# Altium schematic sheet RheoBoard_V8.SchDoc
size A2; SheetNumber: 1; SheetTotal: 1
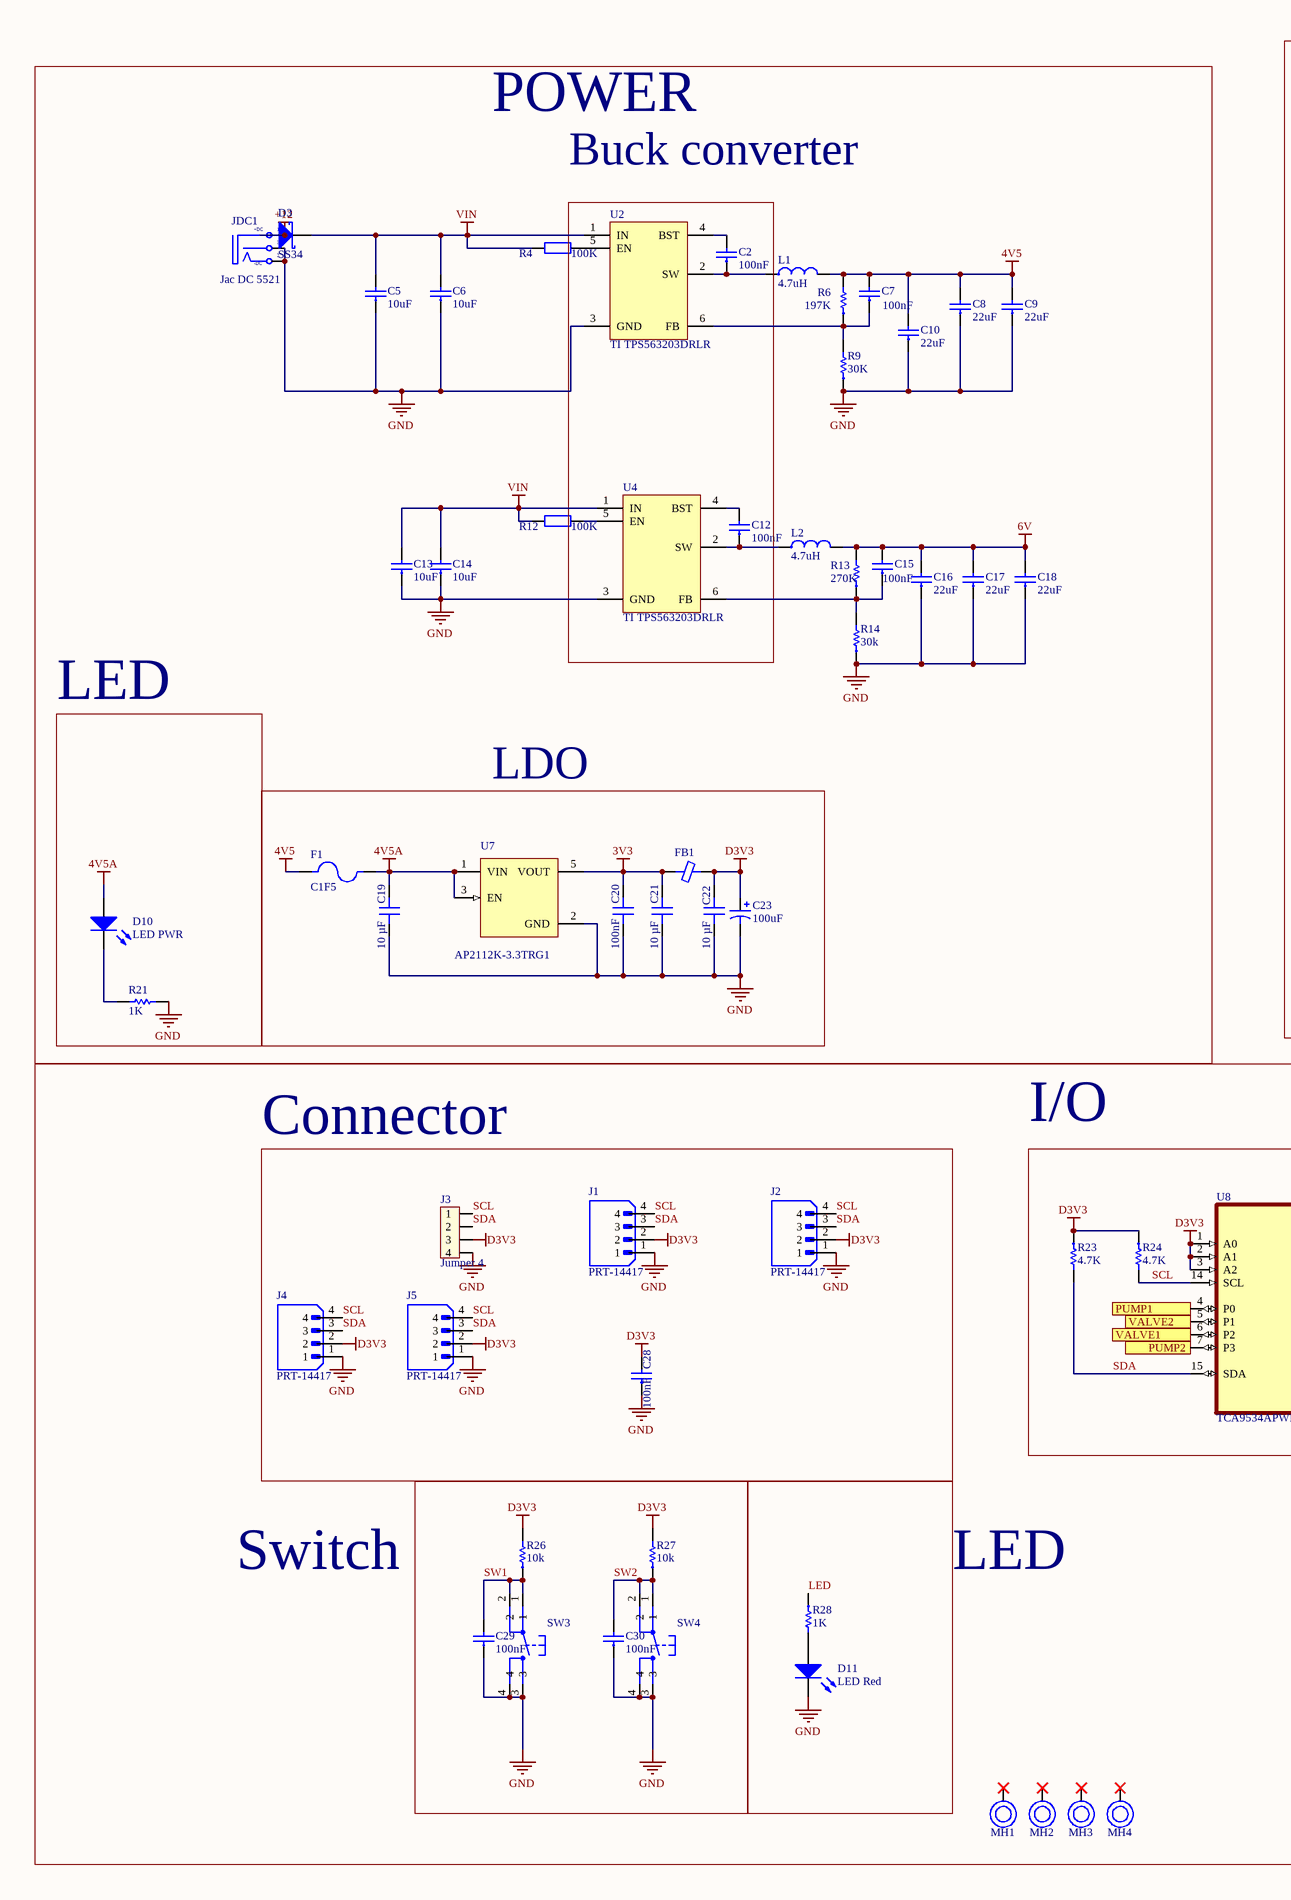
[diagram p0: RheoBoard_V8.SchDoc, left]
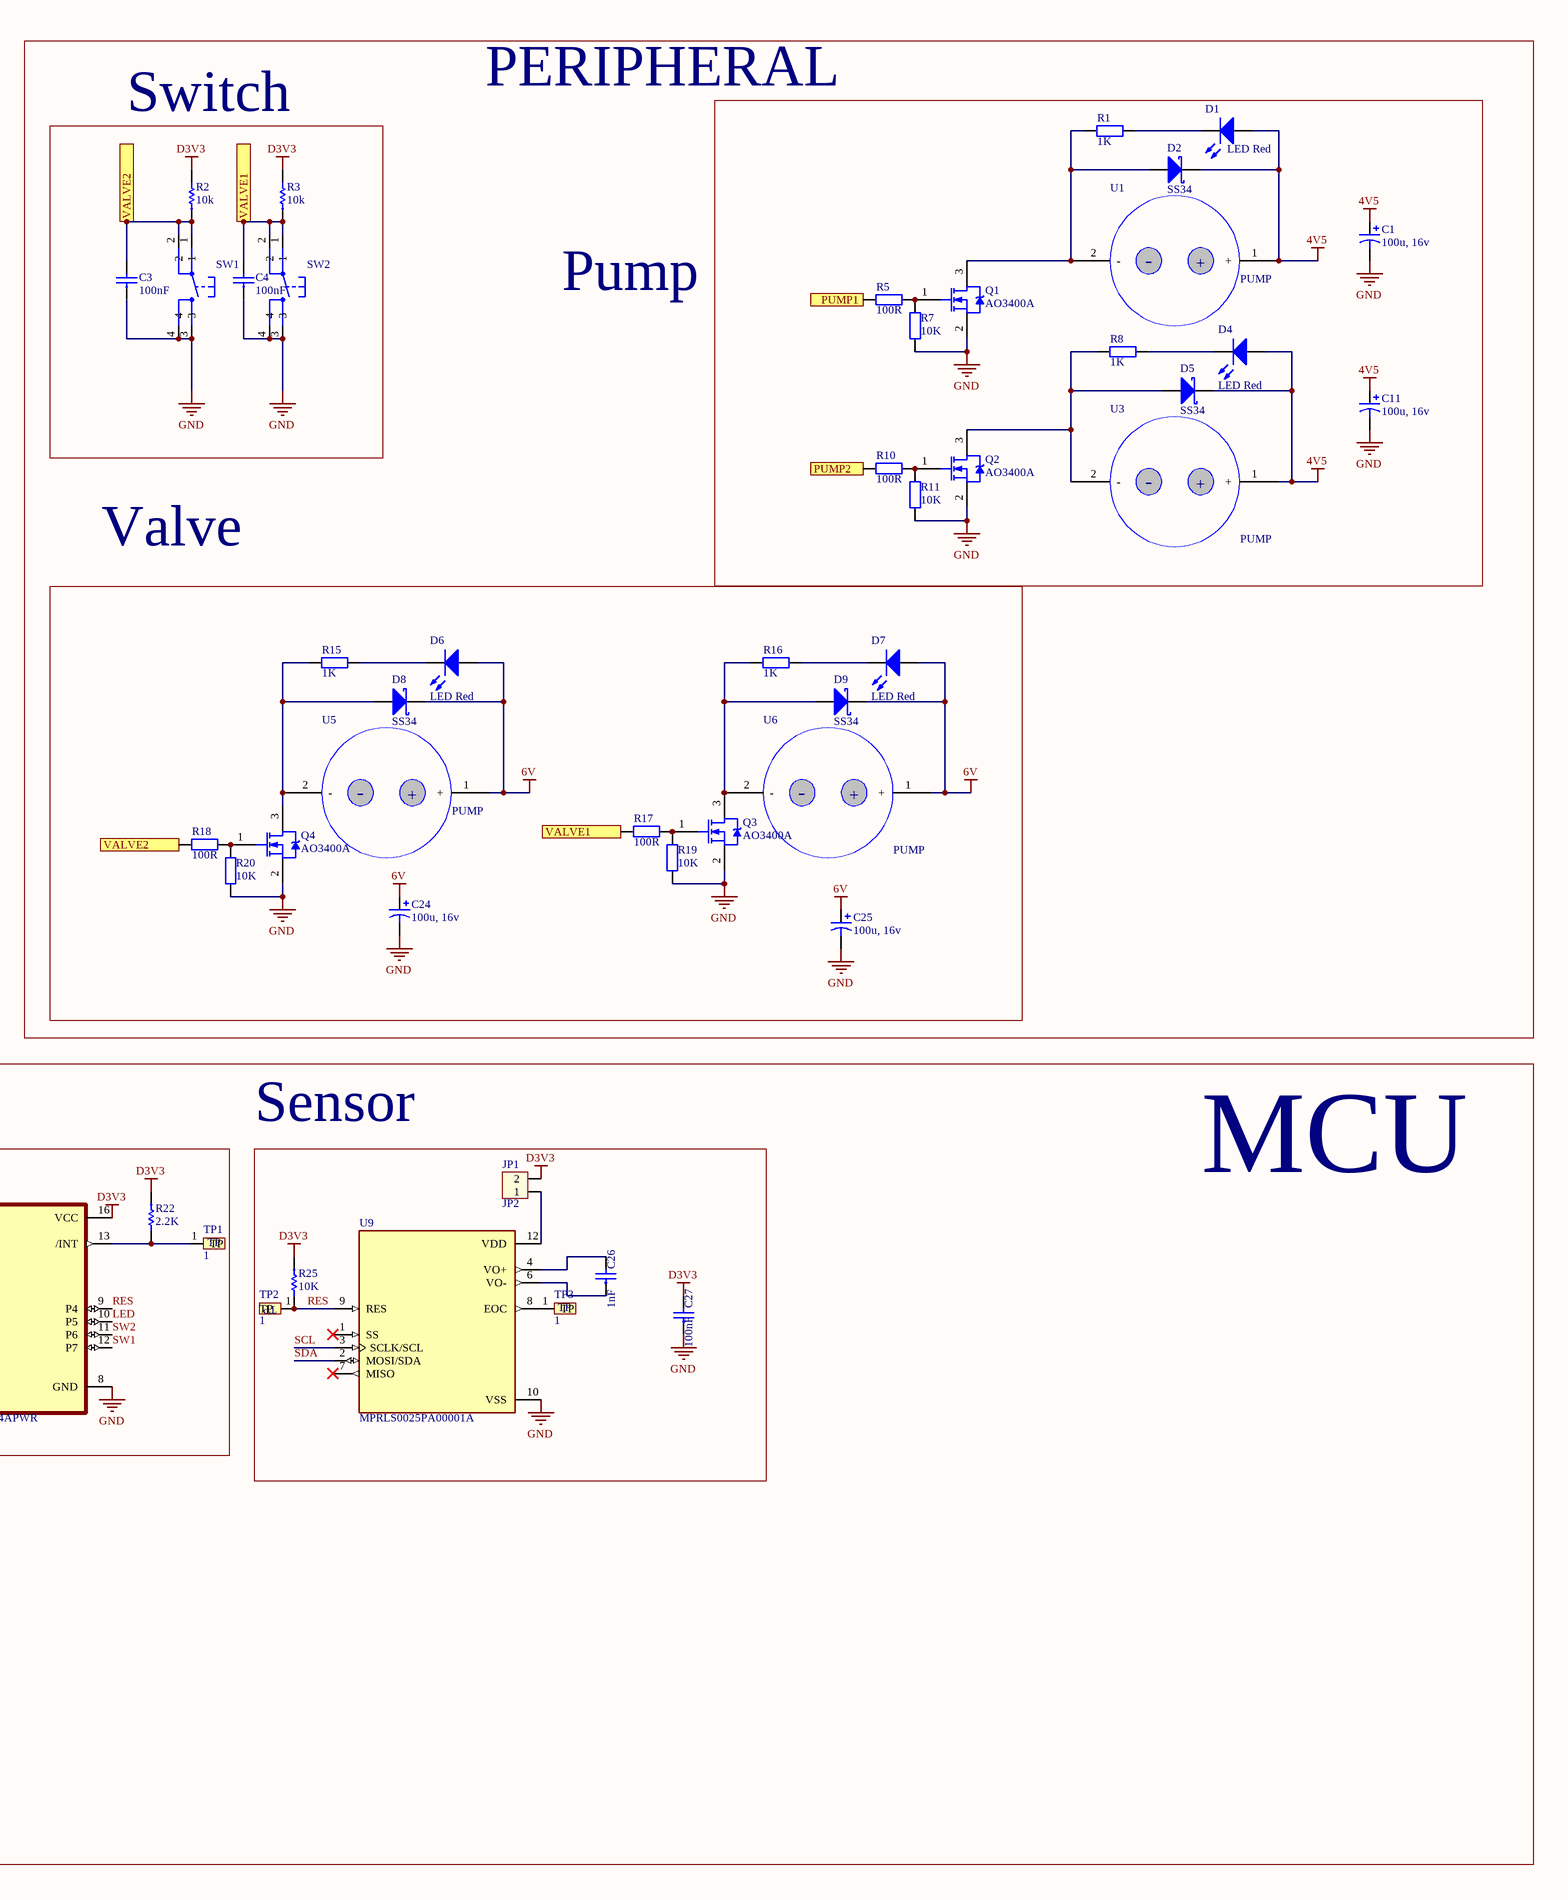
[diagram p1: RheoBoard_V8.SchDoc, right]

## Parts
C1  value 100u, 16v  [CAPACITOR SIZE_D(D6.6)]  (hidden comment: CAP ALUM 100UF 20% 16V SMD)
C2  100nF  [C0603]
C3  100nF  [C0603]
C4  100nF  [C0603]
C5  10uF  [CN-SMD-0603]
C6  10uF  [CN-SMD-0603]
C7  100nF  [C0603]
C8  22uF  [CN-SMD-0603]
C9  22uF  [CN-SMD-0603]
C10  22uF  [CN-SMD-0603]
C11  value 100u, 16v  [CAPACITOR SIZE_D(D6.6)]  (hidden comment: CAP ALUM 100UF 20% 16V SMD)
C12  100nF  [C0603]
C13  10uF  [CN-SMD-0603]
C14  10uF  [CN-SMD-0603]
C15  100nF  [C0603]
C16  22uF  [CN-SMD-0603]
C17  22uF  [CN-SMD-0603]
C18  22uF  [CN-SMD-0603]
C19  10 µF  [C0603]
C20  100nF  [C0603]
C21  10 µF  [C0603]
C22  10 µF  [C0603]
C23  value 100uF  [CAPACITOR SIZE_D(D6.6)]  (hidden comment: CAP ALUM 100UF 20% 16V SMD)
C24  value 100u, 16v  [CAPACITOR SIZE_D(D6.6)]  (hidden comment: CAP ALUM 100UF 20% 16V SMD)
C25  value 100u, 16v  [CAPACITOR SIZE_D(D6.6)]  (hidden comment: CAP ALUM 100UF 20% 16V SMD)
C26  1nF  [C0603]
C27  100nF  [C0603]
C28  100nF  [C0603]
C29  100nF  [C0603]
C30  100nF  [C0603]
D1  LED Red  [LED0603-R]
D2  SS34  [DO-214AC]
D3  SS34  [DO-214AC]
D4  LED Red  [LED0603-R]
D5  SS34  [DO-214AC]
D6  LED Red  [LED0603-R]
D7  LED Red  [LED0603-R]
D8  SS34  [DO-214AC]
D9  SS34  [DO-214AC]
D10  value LED PWR  [LED0603-R]  (hidden comment: LED Red)
D11  LED Red  [LED0603-R]
F1  C1F5  [FUSE C1F5]
FB1  330 Ohms @ 100 MHz  [L0603]  (value not drawn)
J1  PRT-14417  [SPARKFUN_PRT-14417]
J2  PRT-14417  [SPARKFUN_PRT-14417]
J3  Jumper 4  [JP4]
J4  PRT-14417  [SPARKFUN_PRT-14417]
J5  PRT-14417  [SPARKFUN_PRT-14417]
JDC1  Jac DC 5521  [DC0]
JP1  JP2  [CON2]
L1  4.7uH  [IND-0420-2R2]
L2  4.7uH  [IND-0420-2R2]
MH1  MOUNTING HOLE  [M3]  (value not drawn)
MH2  MOUNTING HOLE  [M3]  (value not drawn)
MH3  MOUNTING HOLE  [M3]  (value not drawn)
MH4  MOUNTING HOLE  [M3]  (value not drawn)
Q1  AO3400A  [SOT-23]
Q2  AO3400A  [SOT-23]
Q3  AO3400A  [SOT-23]
Q4  AO3400A  [SOT-23]
R1  value 1K  [R0603]  (hidden comment: RES 1K 5% 1/10W 0603)
R2  10k  [R0603]
R3  10k  [R0603]
R4  value 100K  [R0603]  (hidden comment: RES 100K 5% 1/10W 0603)
R5  value 100R  [R0603]  (hidden comment: RES 100R 5% 1/10W 0603)
R6  197K  [R0603]
R7  value 10K  [R0603]  (hidden comment: RES 10K 5% 1/10W 0603)
R8  value 1K  [R0603]  (hidden comment: RES 1K 5% 1/10W 0603)
R9  30K  [R0603]
R10  value 100R  [R0603]  (hidden comment: RES 100R 5% 1/10W 0603)
R11  value 10K  [R0603]  (hidden comment: RES 10K 5% 1/10W 0603)
R12  value 100K  [R0603]  (hidden comment: RES 100K 5% 1/10W 0603)
R13  270K  [R0603]
R14  30k  [R0603]
R15  value 1K  [R0603]  (hidden comment: RES 1K 5% 1/10W 0603)
R16  value 1K  [R0603]  (hidden comment: RES 1K 5% 1/10W 0603)
R17  value 100R  [R0603]  (hidden comment: RES 100R 5% 1/10W 0603)
R18  value 100R  [R0603]  (hidden comment: RES 100R 5% 1/10W 0603)
R19  value 10K  [R0603]  (hidden comment: RES 10K 5% 1/10W 0603)
R20  value 10K  [R0603]  (hidden comment: RES 10K 5% 1/10W 0603)
R21  1K  [R0603]
R22  2.2K  [R0603]
R23  4.7K  [R0603]
R24  4.7K  [R0603]
R25  10K  [R0603]
R26  10k  [R0603]
R27  10k  [R0603]
R28  1K  [R0603]
SW1  SW2  [SWITCH]  (value not drawn)
SW2  SW2  [SWITCH]  (value not drawn)
SW3  SW2  [SWITCH]  (value not drawn)
SW4  SW2  [SWITCH]  (value not drawn)
TP1  1  [TP]
TP2  1  [TP]
TP3  1  [TP]
U1  PUMP  [Pump]
U2  TI TPS563203DRLR  [SOT50P160X60-6N]
U3  PUMP  [Pump]
U4  TI TPS563203DRLR  [SOT50P160X60-6N]
U5  PUMP  [Pump]
U6  PUMP  [Pump]
U7  AP2112K-3.3TRG1  [SOT-23-5]
U8  TCA9534APWR  [SOP65P640X120-16N]
U9  MPRLS0025PA00001A  [XDCR_MPRLS0025PA00001A]

## Sub-sheets
Buck converter = File Name: no entries
Connector = File Name: no entries
I/O = File Name: no entries
LDO = File Name: no entries
LED = File Name: no entries
LED = File Name: no entries
MCU = File Name: no entries
PERIPHERAL = File Name: no entries
POWER = File Name: no entries
Pump = File Name: no entries
Sensor = File Name: no entries
Switch = File Name: no entries
Switch = File Name: no entries
Valve = File Name: no entries

## Ports
PUMP1 (in), PUMP1 (out), PUMP2 (in), PUMP2 (out), VALVE1 (in), VALVE1 (out), VALVE2 (in), VALVE2 (out)

## Nets
3V3: C20.2 C21.2 FB1.1 U7.5(VOUT)
4V5: C1.1 C7.2 C8.2 C9.2 C10.2 C11.1 D1.1(A) D2.2(K) D4.1(A) D5.2(K) F1.1 L1.2 R6.2 U1.1(+) U3.1(+)
4V5A: C19.2 D10.1(A) F1.2 U7.1(VIN) U7.3(EN)
6V: C15.2 C16.2 C17.2 C18.2 C24.1 C25.1 D6.1(A) D7.1(A) D8.2(K) D9.2(K) L2.2 R13.2 U5.1(+) U6.1(+)
+12: D3.1(A) JDC1.1(T)
D3V3: C22.2 C23.1 C27.2 C28.2 FB1.2 J1.2 J2.2 J3.3 J4.2 J5.2 JP1.2 R2.2 R3.2 R22.1 R23.1 R24.1 R25.1 R26.2 R27.2 U8.1(A0) U8.2(A1) U8.3(A2) U8.16(VCC)
GND: C1.2 C3.1 C4.1 C5.1 C6.1 C8.1 C9.1 C10.1 C11.2 C13.1 C14.1 C16.1 C17.1 C18.1 C19.1 C20.1 C21.1 C22.1 C23.2 C24.2 C25.2 C27.1 C28.1 C29.1 C30.1 D11.2(K) J1.1 J2.1 J3.4 J4.1 J5.1 JDC1.2(TN) JDC1.3(S) Q1.2(S) Q2.2(S) Q3.2(S) Q4.2(S) R7.1 R9.1 R11.1 R14.1 R19.1 R20.1 R21.2 SW1.3 SW1.4 SW2.3 SW2.4 SW3.3 SW3.4 SW4.3 SW4.4 U2.3(GND) U4.3(GND) U7.2(GND) U8.8(GND) U9.10(VSS)
VIN: C5.2 C6.2 C13.2 C14.2 D3.2(K) R4.2 R12.2 U2.1(IN) U4.1(IN)
LED: R28.1 U8.10(P5)
PUMP1: R5.1 U8.4(P0) ; port PUMP1
PUMP2: R10.1 U8.7(P3) ; port PUMP2
RES: R25.2 TP2.1(TP) U8.9(P4) U9.9(RES)
SCL: J1.4 J2.4 J3.1 J4.4 J5.4 R24.2 U8.14(SCL) U9.3(SCLK/SCL)
SDA: J1.3 J2.3 J3.2 J4.3 J5.3 R23.2 U8.15(SDA) U9.2(MOSI/SDA)
SW1: C29.2 R26.1 SW3.1 SW3.2 U8.12(P7)
SW2: C30.2 R27.1 SW4.1 SW4.2 U8.11(P6)
VALVE1: C4.2 R3.1 R17.1 SW2.1 SW2.2 U8.6(P2) ; port VALVE1
VALVE2: C3.2 R2.1 R18.1 SW1.1 SW1.2 U8.5(P1) ; port VALVE2
NetC2_1: C2.1 L1.1 U2.2(SW)
NetC2_2: C2.2 U2.4(BST)
NetC7_1: C7.1 R6.1 R9.2 U2.6(FB)
NetC12_1: C12.1 L2.1 U4.2(SW)
NetC12_2: C12.2 U4.4(BST)
NetC15_1: C15.1 R13.1 R14.2 U4.6(FB)
NetC26_1: C26.1 U9.6(VO-)
NetC26_2: C26.2 U9.4(VO+)
NetD1_2: D1.2(K) R1.2
NetD2_1: D2.1(A) Q1.3(D) R1.1 U1.2(-)
NetD4_2: D4.2(K) R8.2
NetD5_1: D5.1(A) Q2.3(D) R8.1 U3.2(-)
NetD6_2: D6.2(K) R15.2
NetD7_2: D7.2(K) R16.2
NetD8_1: D8.1(A) Q4.3(D) R15.1 U5.2(-)
NetD9_1: D9.1(A) Q3.3(D) R16.1 U6.2(-)
NetD10_2: D10.2(K) R21.1
NetD11_1: D11.1(A) R28.2
NetJP1_1: JP1.1 U9.12(VDD)
NetQ1_1: Q1.1(G) R5.2 R7.2
NetQ2_1: Q2.1(G) R10.2 R11.2
NetQ3_1: Q3.1(G) R17.2 R19.2
NetQ4_1: Q4.1(G) R18.2 R20.2
NetR4_1: R4.1 U2.5(EN)
NetR12_1: R12.1 U4.5(EN)
NetR22_2: R22.2 TP1.1(TP) U8.13(/INT)
NetTP3_1: TP3.1(TP) U9.8(EOC)

Not connected (* = marked no-connect by the designer): MH1 1(GND)*; MH2 1(GND)*; MH3 1(GND)*; MH4 1(GND)*; U9 1(SS)* 7(MISO)*

## Notes on the sheet
- (in symbol DCIN) +DC; -DC

## Library data of the parts
C1 C11 C23-C25 = UWT1C101MCL1GB: Nichicon Aluminum Cap 220uF 10V 20%; Supplier 1: Digi-Key; Supplier Part Number 1: 493-2177-2-ND
C2 C12 = CAPCER0001 100nF 10% 50V X7R 0603 SMD_1: CAP CER 100nF 10% 50V X7R 0603 SMD; LINE: SMT; TYPE: EP; UNIT: PCS; TMG CODE: None; CERTIFICATION: NA; CLASS: B; MOUNT: SMD; TMG PN: CAPCER0001; ComponentLink1Description: Datasheet; ComponentLink1URL: https://datasheet.lcsc.com/lcsc/1811021431_Samsung-Electro-Mechanics-CL10B104KB8NNNC_C1591.pdf; Footprint: 0603
C3 C4 C7 C15 C26-C30 = CAPCER0001 100nF 10% 50V X7R 0603 SMD: CAP CER 100nF 10% 50V X7R 0603 SMD; LINE: SMT; TYPE: EP; UNIT: PCS; TMG CODE: None; CERTIFICATION: NA; CLASS: B; MOUNT: SMD; TMG PN: CAPCER0001; ComponentLink1Description: Datasheet; ComponentLink1URL: https://datasheet.lcsc.com/lcsc/1811021431_Samsung-Electro-Mechanics-CL10B104KB8NNNC_C1591.pdf; Footprint: 0603
C5 C6 C8-C10 C13 C14 C16-C18 = CAPCER0040 10uF 20% 6.3V X5R 0402 SMD: CAP CER 10uF 20% 6.3V X5R 0402 SMD; LINE: SMT; TYPE: EP; UNIT: PCS; TMG PN: CAPCER0013; TMG CODE: None; CERTIFICATION: NA; CLASS: B; MOUNT: SMD; ComponentLink1Description: Datasheet; ComponentLink1URL: https://datasheet.lcsc.com/lcsc/2304140030_YAGEO-CC0402MRX5R5BB106_C105884.pdf; Footprint: 0402
C19 C21 C22 = GMC10X7R106K10NT: CAP0603 X7R 10UF 10% 10V; manufacturer: Cal-Chip Electronics, Inc.; Part Number: GMC10X7R106K10NT; Value: 10 µF; Applications: General Purpose; Capacitance: 10 µF; componentlink1description: Datasheet; componentlink1url: https://88ce57.p3cdn1.secureserver.net/wp-content/uploads/2023/01/gmc_series-2.pdf; componentlink2description: DigiKey Link; componentlink2url: https://www.digikey.com/en/products/detail/cal-chip-electronics-inc/GMC10X7R106K10NT/18151126; Device Package: 0603 (1608 Metric); lastupdated: 2/9/2024 8:09:39 PM; Lifecycle Status: Active; Minimum Order: 1; Mounting Type: Surface Mount, MLCC; Operating Temperature: -55°C ~ 125°C; Package / Case: 0603 (1608 Metric); packaging: TapeAndReel; partid: 49835; Part Status: Active; price: 0.26; series: GMC; Size / Dimension: 0.063" L x 0.031" W (1.60mm x 0.80mm); Supplier 1: DigiKey; Supplier Part Number 1: 4713-GMC10X7R106K10NTCT-ND; Temperature Coefficient: X7R; Thickness (Max): 0.039" (1.00mm); Tolerance: ±10%; Voltage - Rated: 10V
C20 = GMC10X7R106K10NT: CAP0603 X7R 10UF 10% 10V; manufacturer: Cal-Chip Electronics, Inc.; Capacitance: 10 µF; Part Number: GMC10X7R106K10NT; Value: 100nF; Applications: General Purpose; componentlink1description: Datasheet; componentlink1url: https://88ce57.p3cdn1.secureserver.net/wp-content/uploads/2023/01/gmc_series-2.pdf; componentlink2description: DigiKey Link; componentlink2url: https://www.digikey.com/en/products/detail/cal-chip-electronics-inc/GMC10X7R106K10NT/18151126; Device Package: 0603 (1608 Metric); lastupdated: 2/9/2024 8:09:39 PM; Lifecycle Status: Active; Minimum Order: 1; Mounting Type: Surface Mount, MLCC; Operating Temperature: -55°C ~ 125°C; Package / Case: 0603 (1608 Metric); packaging: TapeAndReel; partid: 49835; Part Status: Active; price: 0.26; series: GMC; Size / Dimension: 0.063" L x 0.031" W (1.60mm x 0.80mm); Supplier 1: DigiKey; Supplier Part Number 1: 4713-GMC10X7R106K10NTCT-ND; Temperature Coefficient: X7R; Thickness (Max): 0.039" (1.00mm); Tolerance: ±10%; Voltage - Rated: 10V
D1 D4 D6 D7 D10 D11 = LTST-C190KRKT: Lite-On LED Red 0603; Supplier Part Number 1: 160-1436-1-ND; Supplier 1: Digi-Key; Supplier Part Number 2: FL1413
  D1 D4 D6 D7 D11: Value: LED Red
D2 D3 D5 D8 D9 = SS34: Schottky Diode 40V 3A SMA; Supplier 1: Digi-Key; Supplier Part Number 1: SS34-E3/57TGICT-ND; Value: SS34
F1 = C1F5: Fuse Chip Fast Acting 5A 125V SMD Solder Pad 1206 3.2 X 1.58 X 0.63mm; Manufacturer: Bel TRP; Voltage Rating (DC): 63V; DC Cold Resistance: 20mR; Fuse Type: Board Mount (Cartridge Style Excluded); Supplier 1: Newark; Manufacturer Part Number: C1F5; RoHS: Yes; Category: Uncategorized; Mount: Surface Mount; Case/Package: 1206; Number of Pins: 2; Contact Plating: Tin; Case Code (Metric): 3216; Case Code (Imperial): 1206; Min Operating Temperature: -55°C; Max Operating Temperature: 125°C; Packaging: Cut Tape; Voltage Rating: 125V; Series: C1F; Voltage Rating (AC): 125V; ComponentLink1URL: http://www.mouser.com/ds/2/643/C1F-594910.pdf?src-supplier=Mouser; ComponentLink1Description: http://www.mouser.com/ds/2/643/C1F-594910.pdf?src-supplier=Mouser; ComponentLink2URL: http://belfuse.com/pdfs/C1F.pdf?src-supplier=Avnet; ComponentLink2Description: http://belfuse.com/pdfs/C1F.pdf?src-supplier=Avnet; ComponentLink3URL: https://belfuse.com/resources/datasheets/circuitprotection/ds-cp-c1f-series.pdf?src-supplier=Digikey; ComponentLink3Description: https://belfuse.com/resources/datasheets/circuitprotection/ds-cp-c1f-series.pdf?src-supplier=Digikey; Supplier Part Number 1: 48AC8480
FB1 = BLM18KG331SH1D: FERRITE BEAD 330 OHM 0603 1LN; Manufacturer: Murata Electronics; Current Rating (Max): 1.7A; DC Resistance (DCR) (Max): 80mOhm; Filter Type: Power Line; Number of Lines: 1; Part Number: BLM18KG331SH1D; ComponentLink1Description: Datasheet; ComponentLink1URL: https://www.murata.com/en-global/products/productdata/8796737273886/QNFA9101.pdf; ComponentLink2Description: DigiKey Link; ComponentLink2URL: https://www.digikey.com/en/products/detail/murata-electronics/BLM18KG331SH1D/5881246; Device Package: 0603 (1608 Metric); Height (Max): 0.037" (0.95mm); Impedance @ Frequency: 330 Ohms @ 100 MHz; LastUpdated: 3/11/2024 7:43:28 AM; Lifecycle Status: Active; Minimum Order: 1; Mounting Type: Surface Mount; Operating Temperature: -55°C ~ 125°C; Package / Case: 0603 (1608 Metric); Packaging: TapeAndReel; PartId: 932; Part Status: Active; Price: 0.02; Ratings: AEC-Q200; Series: EMIFIL®, BLM18; Size / Dimension: 0.063" L x 0.032" W (1.60mm x 0.80mm); Supplier 1: DigiKey; Supplier Part Number 1: 490-13257-1-ND; Value: 330 Ohms @ 100 MHz
J1 J2 J4 J5 = PRT-14417: QWIIC JST CONNECTOR - SMD 4-PIN; MF: SparkFun Electronics; SnapEDA_Link: https://www.snapeda.com/parts/PRT-14417/SparkFun+Electronics/view-part/?ref=snap; Package: None; Value: *; MP: PRT-14417; Check_prices: https://www.snapeda.com/parts/PRT-14417/SparkFun+Electronics/view-part/?ref=eda
J3 = JP4: Jumper 3; Value: J3
JDC1 = DCIN: Jac DC input; Value: Jac DC
JP1 = Con2: Connector 2; Value: Connector 2
L1 L2 = INDMOI0016 1W2T 2.2uH 20% 5A 0420 SMD: IND MOI 1W2T 2.2uH 20% 5A 0420 SMD; LINE: SMT; TYPE: EP; UNIT: PCS; TMG CODE: None; CERTIFICATION: NA; CLASS: B; MOUNT: SMD; ComponentLink1Description: Datasheet; ComponentLink1URL: https://datasheet.lcsc.com/lcsc/2305161117_cjiang--Changjiang-Microelectronics-Tech-FXL0420-2R2-M_C167206.pdf
MH1-MH4 = MH
Q1-Q4 = IRFML8244TRPBF: MOSFET N-CH 25V 5.8A SOT23; Supplier 1: Digi-Key; Supplier Part Number 1: IRFML8244TRPBFCT-ND; Value: AO3400A
R1 R8 R15 R16 = RC0603JR-071KL: Yageo RES 1K 5% 1/10W 0603; Supplier 1: LCSC; Supplier Part Number 1: C131707
R2 R3 R22-R28 = RESCHP0428 8K4 1% 0603 SMD: RES CHP 8K4 1% 1/10W 0603 SMD; LINE: SMT; UNIT: PCS; TMG CODE: None; CERTIFICATION: NA; CLASS: B; MOUNT: SMD; TYPE: EP; ComponentLink1Description: Datasheet; ComponentLink1URL: https://datasheet.lcsc.com/lcsc/2304140030_YAGEO-RT0603FRD07100RL_C160603.pdf
R4 R12 = RC0603JR-07100KL: Yageo RES 100K 5% 1/10W 0603; Supplier 1: Digi-Key; Supplier Part Number 1: 311-100KGRCT-ND; Supplier Part Number 2: FL2402
R5 R10 R17 R18 = RC0603JR-07100RL: Yageo RES 100R 5% 1/10W 0603; Supplier 1: Digi-Key; Supplier Part Number 1: 311-100GRCT-ND; Supplier Part Number 2: FL2438
R6 R9 R13 R14 = RESCHP0195 2K7 1% 0603 SMD: RES CHP 2K7 1% 1/10W 0603 SMD; LINE: SMT; UNIT: PCS; TMG CODE: None; CERTIFICATION: NA; CLASS: B; MOUNT: SMD; TYPE: EP; TMG PN: RESCHP0195; ComponentLink1Description: Datasheet; ComponentLink1URL: https://datasheet.lcsc.com/lcsc/2304140030_YAGEO-RC0603FR-072K7L_C114612.pdf; Footprint: 0603
R7 R11 R19 R20 = RC0603JR-0710KL: Yageo RES 10K 5% 1/10W 0603; Supplier 1: Digi-Key; Supplier Part Number 1: 311-10KGRCT-ND; Supplier Part Number 2: FL2403
R21 = Resistor 2.2K: Res Thick Film 0603 2.2K Ohm 5% 1/10W ±200ppm/°C Molded SMD SMD Paper T/R; Manufacturer: Vishay; Manufacturer Part Number: CRCW06032K20JNEA; Resistance: 2.2kR; Power Rating: 100mW; Voltage Rating: 75V; Value: 2.2kR; Supplier 1: Arrow Electronics; RoHS: Yes; Category: Chip SMD Resistors; Stock 1: 130000; Pricing 1: 5000=0.0053 (USD); Case/Package: 0603; Weight: 7.1E-05oz; Case Code (Metric): 1608; Case Code (Imperial): 0603; Contact Plating: Tin; Size Code: 0603; Min Operating Temperature: -55°C; Max Operating Temperature: 155°C; Package Quantity: 5000; Tolerance: 5%; Packaging: Tape and Reel; Resistor Type: Thick Film; Number of Terminations: 2; Temperature Coefficient: 200ppm/°C; Termination: SMD/SMT; Max Power Dissipation: 100mW; Features: Automotive AEC-Q200; Series: CRCW; Resistance Tolerance: 5%; Construction: Rectangular; Length: 1.55mm; Width: 0.85mm; Height: 0.45mm; Depth: 0.85mm; Ratings: AEC-Q200; Radiation Hardening: No; Military Standard: Not; RoHS Compliant: Yes; Reach SVHC Compliant: Unknown; Lead Free: 5697LeadFree; ComponentLink1URL: https://datasheet.ciiva.com/2462/dcrcwe3-2462048.pdf?src-supplier=Digikey; ComponentLink1Description: https://datasheet.ciiva.com/2462/dcrcwe3-2462048.pdf?src-supplier=Digikey; ComponentLink2URL: https://datasheet.ciiva.com/16767/70201119-16767464.pdf?src-supplier=Allied+Electronics; ComponentLink2Description: https://datasheet.ciiva.com/16767/70201119-16767464.pdf?src-supplier=Allied+Electronics; ComponentLink3URL: https://datasheet.ciiva.com/2462/dcrcwe3-2462046.pdf?src-supplier=Digikey; ComponentLink3Description: https://datasheet.ciiva.com/2462/dcrcwe3-2462046.pdf?src-supplier=Digikey; ComponentLink4URL: https://datasheet.ciiva.com/5541/dcrcwe3-109170-5541959.pdf?src-supplier=Mouser; ComponentLink4Description: https://datasheet.ciiva.com/5541/dcrcwe3-109170-5541959.pdf?src-supplier=Mouser; ComponentLink5URL: https://datasheet.ciiva.com/16286/dcrcwe3-16286997.pdf?src-supplier=Future+Electronics; ComponentLink5Description: https://datasheet.ciiva.com/16286/dcrcwe3-16286997.pdf?src-supplier=Future+Electronics; Supplier Part Number 1: CRCW06032K20JNEA
SW1-SW4 = SW2: Switch button 4 pin
TP1-TP3 = TP: CONNECT 1
U1 U3 U5 U6 = A5F083: Connector Header 2 Position 6.35mm Solder Straight Thru-Hole 2 Terminal 1 Port MLX-Series; Manufacturer: Molex; Manufacturer Lifecycle Status: ACTIVE; Connector Type: Power; Contact Resistance: 3.5mΩ; Current Rating: 13.5A; Dielectric Material: Polyester; Gender: Female; Glow Wire Compliant: Non-compliant; Insulation Resistance: 1GΩ; Number of Circuits: 2; Operating Force: 6.672N; Plating: Tin; Plating Thickness: 3.5052µm; Voltage Rating: 600V; Supplier 1: Arrow Electronics; Manufacturer Part Number: 10-84-4022; RoHS: Compliant; Category: Headers and Wire Housings; Stock 1: 4724; Pricing 1: 1=0,2907, 10=0,267, 100=0,245, 500=0,229, 1836=0,216 (USD); China RoHS: Compliant; Color: Natural; Contact Gender: Female; Contact Material: Bronze; Contact Plating: Tin; Country of Origin: US; Flammability Rating: UL94 V-2; Halogen Free: Low Halogen; Housing Material: Nylon; Lead Free: Lead Free; Lifecycle Status: Production; Max Operating Temperature: 105°C; Min Operating Temperature: -55°C; Mount: Through Hole; Number of Contacts: 2; Number of Pins: 2; Number of Positions: 2; Number of Rows: 1; Orientation: Vertical; Packaging: Carton; Pitch: 6.35mm; Radiation Hardening: No; REACH SVHC: Yes; Schedule B: 8536694040, 8536694040|8536694040|8536694040|8536694040|8536694040; Shell Material: POLYAMIDE66; Terminal Pitch: 6.35mm; Termination: Solder; ComponentLink1URL: https://datasheet.octopart.com:443/10-84-4022-Molex-datasheet-137053637.pdf?src-supplier=element14+APAC; ComponentLink1Description: https://datasheet.octopart.com:443/10-84-4022-Molex-datasheet-137053637.pdf?src-supplier=element14+APAC; ComponentLink2URL: https://datasheet.octopart.com:443/10-84-4022-Molex-datasheet-13791970.pdf?src-supplier=Molex; ComponentLink2Description: https://datasheet.octopart.com:443/10-84-4022-Molex-datasheet-13791970.pdf?src-supplier=Molex; ComponentLink3URL: https://sigma.octopart.com:443/16272272/technical_drawing/Molex-10-84-4022.pdf?src-supplier=Molex; ComponentLink3Description: https://sigma.octopart.com:443/16272272/technical_drawing/Molex-10-84-4022.pdf?src-supplier=Molex; ComponentLink4URL: https://datasheet.octopart.com:443/010844022-Molex-datasheet-5390850.pdf?src-supplier=Molex; ComponentLink4Description: https://datasheet.octopart.com:443/010844022-Molex-datasheet-5390850.pdf?src-supplier=Molex; ComponentLink5URL: https://datasheet.octopart.com:443/10-84-4022-Molex-datasheet-154742841.pdf?src-supplier=Master+Electronics; ComponentLink5Description: https://datasheet.octopart.com:443/10-84-4022-Molex-datasheet-154742841.pdf?src-supplier=Master+Electronics; ComponentLink6URL: https://datasheet.octopart.com:443/10-84-4022-Molex-datasheet-33343972.pdf?src-supplier=Electro+Sonic; ComponentLink6Description: https://datasheet.octopart.com:443/10-84-4022-Molex-datasheet-33343972.pdf?src-supplier=Electro+Sonic; ComponentLink7URL: https://datasheet.octopart.com:443/10-84-4022-Molex-datasheet-21205596.pdf?src-supplier=Electro+Sonic; ComponentLink7Description: https://datasheet.octopart.com:443/10-84-4022-Molex-datasheet-21205596.pdf?src-supplier=Electro+Sonic; ComponentLink8URL: https://datasheet.octopart.com:443/10-84-4022-Molex-datasheet-62102692.pdf?src-supplier=Electro+Sonic; ComponentLink8Description: https://datasheet.octopart.com:443/10-84-4022-Molex-datasheet-62102692.pdf?src-supplier=Electro+Sonic; ComponentLink9URL: https://datasheet.octopart.com:443/10-84-4022-Molex-datasheet-140174504.pdf?src-supplier=RS+(Formerly+Allied+Electronics); ComponentLink9Description: https://datasheet.octopart.com:443/10-84-4022-Molex-datasheet-140174504.pdf?src-supplier=RS+(Formerly+Allied+Electronics); ComponentLink10URL: https://datasheet.octopart.com:443/10-84-4022-Molex-datasheet-120134962.pdf?src-supplier=RS+(Formerly+Allied+Electronics); ComponentLink10Description: https://datasheet.octopart.com:443/10-84-4022-Molex-datasheet-120134962.pdf?src-supplier=RS+(Formerly+Allied+Electronics); ComponentLink11URL: https://datasheet.octopart.com:443/10-84-4022-Molex-datasheet-32867450.pdf?src-supplier=Newark; ComponentLink11Description: https://datasheet.octopart.com:443/10-84-4022-Molex-datasheet-32867450.pdf?src-supplier=Newark; ComponentLink12URL: https://datasheet.octopart.com:443/10844022-Molex-datasheet-8320017.pdf?src-supplier=Jameco; ComponentLink12Description: https://datasheet.octopart.com:443/10844022-Molex-datasheet-8320017.pdf?src-supplier=Jameco; ComponentLink13URL: https://datasheet.octopart.com:443/10-84-4022-Molex-datasheet-5314522.pdf?src-supplier=Verical; ComponentLink13Description: https://datasheet.octopart.com:443/10-84-4022-Molex-datasheet-5314522.pdf?src-supplier=Verical; ComponentLink14URL: https://datasheet.octopart.com:443/10-84-4022-Molex-datasheet-27226.pdf?src-supplier=DigiKey; ComponentLink14Description: https://datasheet.octopart.com:443/10-84-4022-Molex-datasheet-27226.pdf?src-supplier=DigiKey; ComponentLink15URL: http://sigma.octopart.com:80/16272275/rohs_statement/Molex-10-84-4022.pdf?src-supplier=Compliance+Statements; ComponentLink15Description: http://sigma.octopart.com:80/16272275/rohs_statement/Molex-10-84-4022.pdf?src-supplier=Compliance+Statements; ComponentLink16URL: http://sigma.octopart.com:80/reach_statement/Molex-company-74.pdf?src-supplier=Compliance+Statements; ComponentLink16Description: http://sigma.octopart.com:80/reach_statement/Molex-company-74.pdf?src-supplier=Compliance+Statements; ComponentLink17URL: http://sigma.octopart.com:80/rohs_statement/Molex-company-73.pdf?src-supplier=Compliance+Statements; ComponentLink17Description: http://sigma.octopart.com:80/rohs_statement/Molex-company-73.pdf?src-supplier=Compliance+Statements; ComponentLink18URL: http://sigma.octopart.com:80/conflict_mineral_statement/Molex-company-72.pdf?src-supplier=Compliance+Statements; ComponentLink18Description: http://sigma.octopart.com:80/conflict_mineral_statement/Molex-company-72.pdf?src-supplier=Compliance+Statements; Supplier Part Number 1: 0010844022
U2 U4 = ICSOCV0021 BCK TPS563201 3A SOT23-6 SMD: ICS OCV BCK TPS563201 3A SOT23-6 SMD; LINE: SMT; UNIT: PCS; TMG CODE: None; CERTIFICATION: NA; CLASS: B; MOUNT: SMD; TYPE: EP; ComponentLink1Description: Datasheet; ComponentLink1URL: https://datasheet.lcsc.com/lcsc/2304241919_Texas-Instruments-TPS563201DDCR_C116592.pdf
U7 = AP2112K-3.3TRG1: AP2112 Series 0.6 A 3.3 V Fixed Output SMT LDO Linear Regulator - SOT23-5; MF: Diodes Inc.; Value: 1K; Availability: Unavailable; Package: SOT-753 Diodes Inc.; Price: None; SnapEDA_Link: https://www.snapeda.com/parts/AP2112K-3.3TRG1/Diodes%20Inc./view-part/?ref=snap; MP: AP2112K-3.3TRG1
U8 = TCA9534APWR: 8-bit 1.65- to 5.5-V I2C/SMBus I/O expander with interrupt, & config registers; MF: Texas Instruments; SnapEDA_Link: https://www.snapeda.com/parts/TCA9534APWR/Texas+Instruments/view-part/?ref=snap; Package: TSSOP-16 Texas Instruments; Value: *; MP: TCA9534APWR; Check_prices: https://www.snapeda.com/parts/TCA9534APWR/Texas+Instruments/view-part/?ref=eda
U9 = MPRLS0025PA00001A: Pressure Sensor 25PSI _172.37kPa_ Absolute Male - 0.1 _2.5mm_ Tube 24 b 12-SMD Module; MF: Honeywell Sensing; MP: MPRLS0025PA00001A; SnapEDA_Link: https://www.snapeda.com/parts/MPRLS0025PA00001A/Honeywell%20Sensing%20and%20Productivity%20Solutions/view-part/2772767/?ref=snap; Digi-Key_Part_Number: 480-7098-1-ND; Package: SMD-10 Honeywell; Value: *